# EAGLE schematic Speaker (EAGLE 9.6.2)
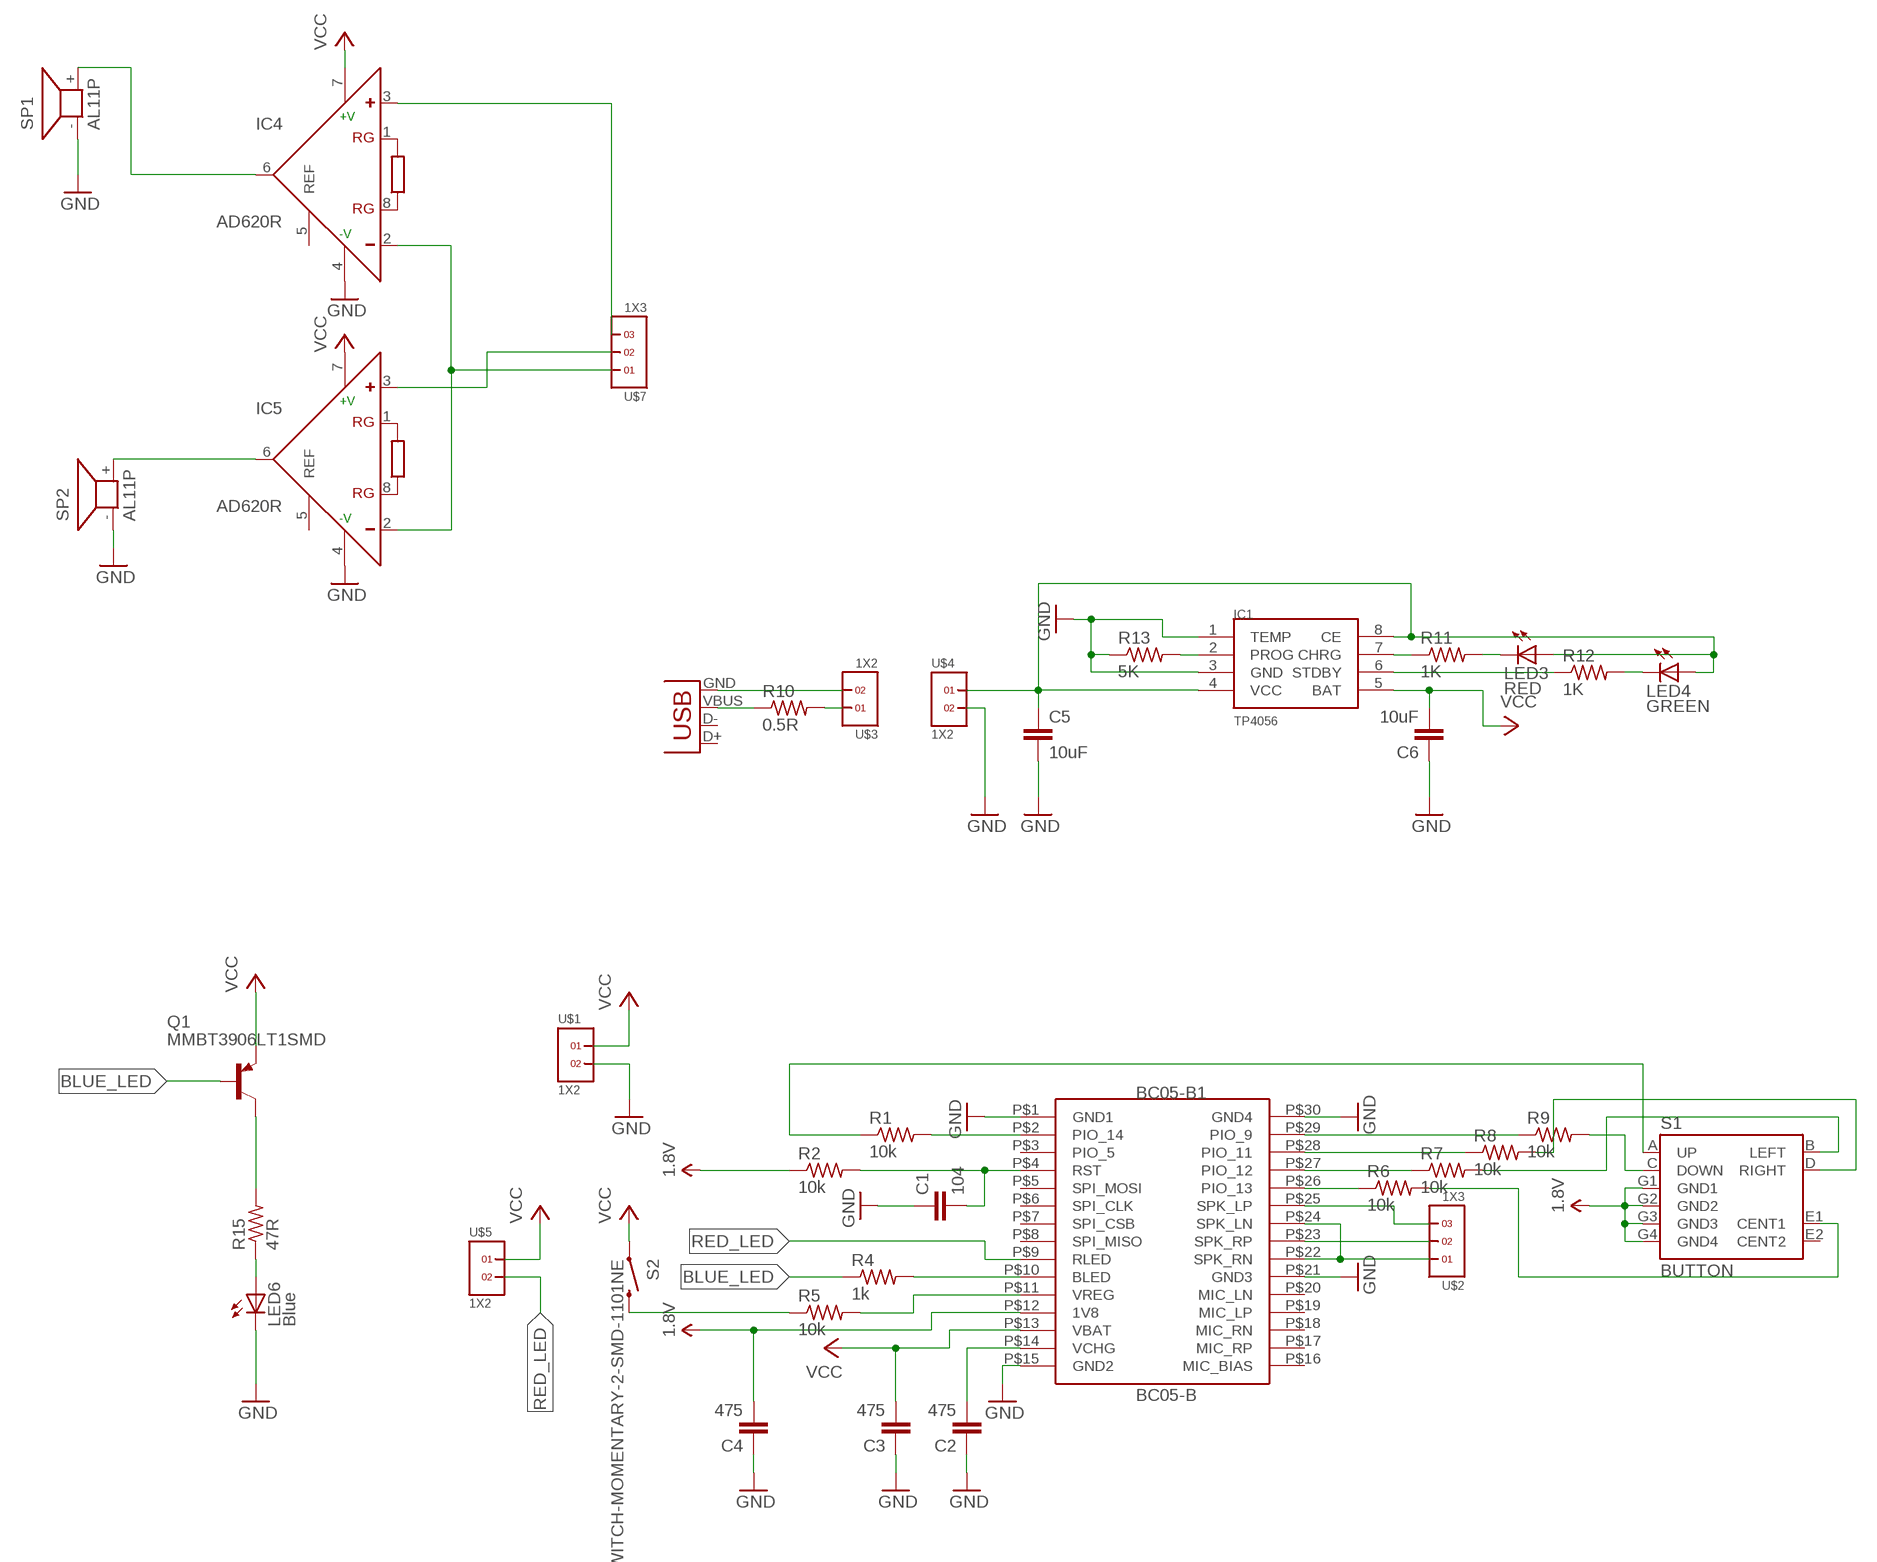
[diagram p0: schematic, sheet 1]

## Parts
BC05-B1  BC05-B  [BC05-B]
C1  104  C-EUC0603K  [C0603K]
C2  475  C-EUC0603K  [C0603K]
C3  475  C-EUC0603K  [C0603K]
C4  475  C-EUC0603K  [C0603K]
C5  10uF  C-EUC0805K  [C0805K]
C6  10uF  C-EUC0805K  [C0805K]
IC1  TP4056  [SOP-8]
IC4  AD620R  [SO8]
IC5  AD620R  [SO8]
LED3  RED  LEDCHIP-LED0805  [CHIP-LED0805]
LED4  GREEN  LEDCHIP-LED0805  [CHIP-LED0805]
LED6  Blue  LEDCHIP-LED0805  [CHIP-LED0805]
Q1  MMBT3906LT1SMD  [SOT23-BEC]
R1  10k  R-US_R0603  [R0603]
R2  10k  R-US_R0603  [R0603]
R4  1k  R-US_R0603  [R0603]
R5  10k  R-US_R0603  [R0603]
R6  10k  R-US_R0603  [R0603]
R7  10k  R-US_R0603  [R0603]
R8  10k  R-US_R0603  [R0603]
R9  10k  R-US_R0603  [R0603]
R10  0.5R  R-US_M0805  [M0805]
R11  1K  R-US_R0603  [R0603]
R12  1K  R-US_R0603  [R0603]
R13  5K  R-US_R0603  [R0603]
R15  47R  R-US_R0603  [R0603]
S1  BUTTON  [BUTTON]
S2  SWITCH-MOMENTARY-2-SMD-1101NE  [TACTILE-SWITCH-1101NE]
SP1  AL11P  [AL11P]
SP2  AL11P  [AL11P]
U$1  1X2  [1X2]
U$2  1X3  [1X3]
U$3  1X2  [1X2]
U$4  1X2  [1X2]
U$5  1X2  [1X2]
U$7  1X3  [1X3]
X1  USB-MICROB  [USB-MICROB]

## Nets
1.8V: BC05-B1.P$12(1V8) C4.2 R2.1 S1.G1(GND1) S1.G2(GND2) S1.G3(GND3) S1.G4(GND4)
BLUE_LED: Q1.B R4.1
GND: BC05-B1.P$1(GND1) BC05-B1.P$15(GND2) BC05-B1.P$21(GND3) BC05-B1.P$30(GND4) C1.1 C2.1 C3.1 C4.1 C5.2 C6.1 IC1.1(TEMP) IC1.3(GND) IC4.4(-V) IC5.4(-V) LED6.C R13.1 SP1.- SP2.- U$1.2 U$4.2
N$1: BC05-B1.P$2(PIO_14) R1.2
N$2: BC05-B1.P$4(RST) C1.2 R2.2
N$3: BC05-B1.P$11(VREG) R5.2
N$4: BC05-B1.P$10(BLED) R4.2
N$5: IC4.2(-) IC5.2(-) U$7.1
N$8: BC05-B1.P$23(SPK_RP) U$2.2
N$9: BC05-B1.P$29(PIO_9) R9.1
N$10: BC05-B1.P$28(PIO_11) R8.1
N$11: BC05-B1.P$27(PIO_12) R7.1
N$12: BC05-B1.P$26(PIO_13) R6.1
N$13: R7.2 S1.B(LEFT)
N$14: R8.2 S1.D(RIGHT)
N$15: R6.2 S1.E1(CENT1)
N$16: R10.2 U$3.1
N$17: R1.1 S1.A(UP)
N$18: R5.1 S2.P$2
N$19: BC05-B1.P$25(SPK_LP) U$2.3
N$20: BC05-B1.P$14(VCHG) C2.2
N$21: BC05-B1.P$22(SPK_RN) BC05-B1.P$24(SPK_LN) U$2.1
N$22: R10.1 X1.VBUS
N$23: C5.1 IC1.4(VCC) IC1.8(CE) LED3.A LED4.A U$4.1
N$24: IC1.7(CHRG) R11.1
N$25: LED3.C R11.2
N$26: LED4.C R12.2
N$27: IC1.6(STDBY) R12.1
N$28: IC5.3(+) U$7.2
N$30: IC1.2(PROG) R13.2
N$31: LED6.A R15.1
N$32: IC4.3(+) U$7.3
N$33: R9.2 S1.C(DOWN)
N$34: U$3.2 X1.GND
N$35: Q1.C R15.2
N$41: IC4.6(OUT) SP1.+
N$42: IC5.6(OUT) SP2.+
RED_LED: BC05-B1.P$9(RLED) U$5.2
VCC: BC05-B1.P$13(VBAT) C3.2 C6.2 IC1.5(BAT) IC4.7(+V) IC5.7(+V) Q1.E S2.P$1 U$1.1 U$5.1
Unconnected: BC05-B1.P$3(PIO_5) BC05-B1.P$5(SPI_MOSI) BC05-B1.P$6(SPI_CLK) BC05-B1.P$7(SPI_CSB) BC05-B1.P$8(SPI_MISO) BC05-B1.P$16(MIC_BIAS) BC05-B1.P$17(MIC_RP) BC05-B1.P$18(MIC_RN) BC05-B1.P$19(MIC_LP) BC05-B1.P$20(MIC_LN) IC4.1(RG) IC4.5(REF) IC4.8(RG) IC5.1(RG) IC5.5(REF) IC5.8(RG) S1.E2(CENT2) X1.D+ X1.D-

## Library data of the parts
BC05-B1 = ggaqquay:BC05-B
C1-C6 = resistor:C-EU: CAPACITOR, European symbol
IC1 = TP4056:TP4056
IC4 IC5 = analog-devices:AD620: Low Cost, Low Power, Instrumentation Amplifier Source: http://www.analog.com/UploadedFiles/Data_Sheets/37793330023930AD620_e.pdf; MPN: AD620AR; OC_FARNELL: 1464424; OC_NEWARK: 05F7109
LED3 LED4 LED6 = adafruit:LED: LED OSRAM: - CHIPLED LG R971, LG N971, LY N971, LG Q971, LY Q971, LO R971, LY R971 LH N974, LH R974 LS Q976, LO Q976, LY Q976 LO Q996 - Hyper CHIPLED LW Q18S LB Q993, LB Q99A, LB R99A - SideLED LS A670, LO A670, LY A670, LG A670, LP A670 LB A673, LV A673, LT A673, LW A673 LH A674 LY A675 LS A676, LA A676, LO A676, LY A676, LW A676 LS A679, LY A679, LG A679 - Hyper Micro SIDELED® LS Y876, LA Y876, LO Y876, LY Y876 LT Y87S - SmartLED LW L88C, LW L88S LB L89C, LB L89S, LG L890 LS L89K, LO L89K, LY L89K LS L896, LA L896, LO L896, LY L896 - TOPLED LS T670, LO T670, LY T670, LG T670, LP T670 LSG T670, LSP T670, LSY T670, LOP T670, LYG T670 LG T671, LOG T671, LSG T671 LB T673, LV T673, LT T673, LW T673 LH T674 LS T676, LA T676, LO T676, LY T676, LB T676, LH T676, LSB T676, LW T676 LB T67C, LV T67C, LT T67C, LS T67K, LO T67K, LY T67K, LW E67C LS E67B, LA E67B, LO E67B, LY E67B, LB E67C, LV E67C, LT E67C LW T67C LS T679, LY T679, LG T679 LS T770, LO T770, LY T770, LG T770, LP T770 LB T773, LV T773, LT T773, LW T773 LH T774 LS E675, LA E675, LY E675, LS T675 LS T776, LA T776, LO T776, LY T776, LB T776 LHGB T686 LT T68C, LB T68C - Hyper Mini TOPLED® LB M676 - Mini TOPLED Santana® LG M470 LS M47K, LO M47K, LY M47K Source: http://www.osram.convergy.de/
Q1 = transistor-pnp:MMBT3906*: PNP Transistror
R1 R2 R4-R13 R15 = resistor:R-US_: RESISTOR, American symbol
S1 = ggaqquay:BUTTON
S2 = SparkFun-Electromechanical:SWITCH-MOMENTARY-2: Various NO switches- pushbuttons, reed, etc
SP1 SP2 = buzzer:AL11P: SPEAKER Source: Buerklin; OC_FARNELL: unknown; OC_NEWARK: unknown
U$1 U$3-U$5 = headers(2mm):1X2
U$2 U$7 = headers(2mm):1X3
X1 = SparkFun:USB: USB Connectors USB-B-PTH is fully proven SKU : PRT-00139 USB-miniB is fully proven SKU : PRT-00587 USB-A-PCB is untested. USB-A-H is throughly reviewed, but untested. Spark Fun Electronics SKU : PRT-00437 USB-B-SMT is throughly reviewed, but untested. Needs silkscreen touching up. USB-A-S has not been used/tested USB-MB-H has not been used/tested